# Altium schematic sheet 21 BOOT SELECT.SchDoc
size 513 x 386 mm
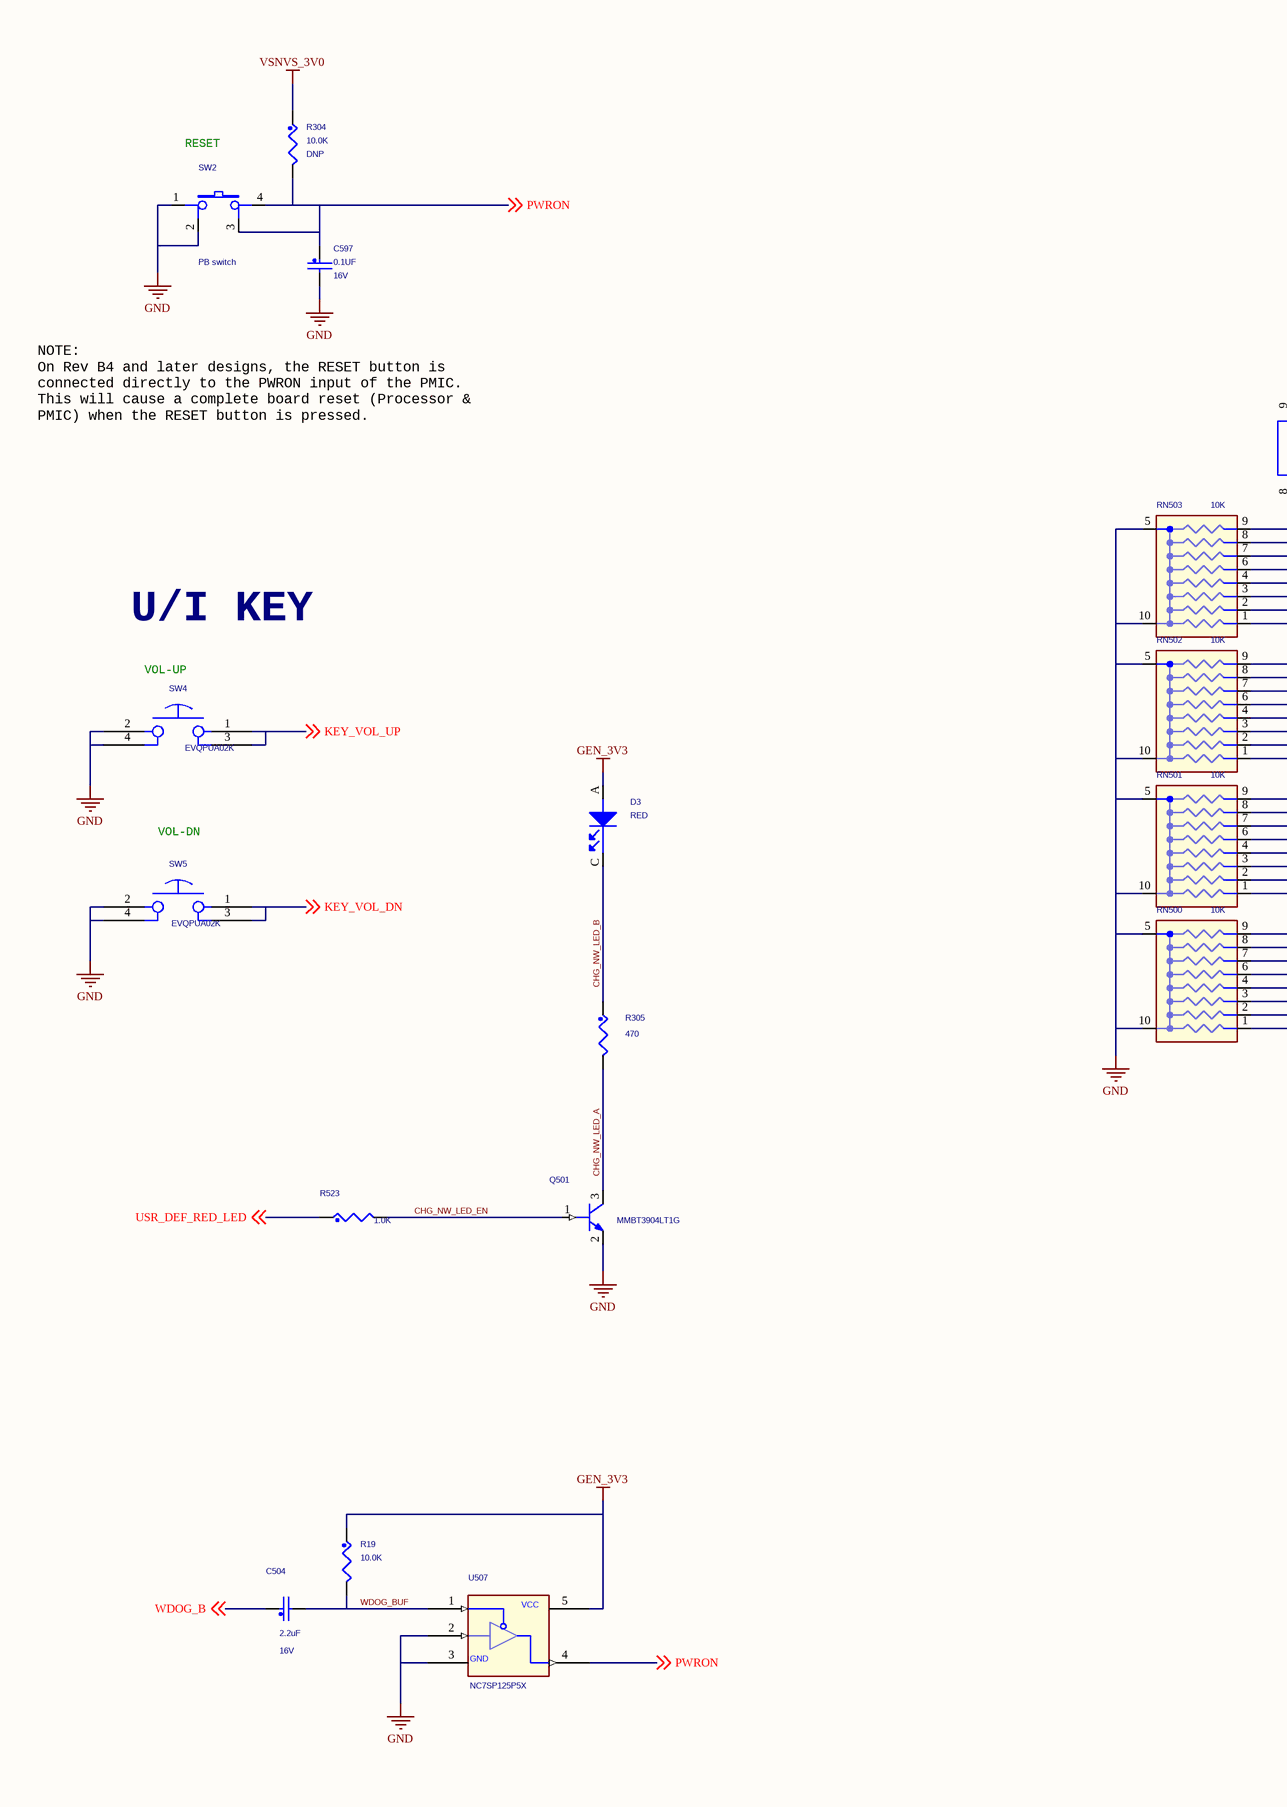
[diagram p0: 21 BOOT SELECT.SchDoc, left]
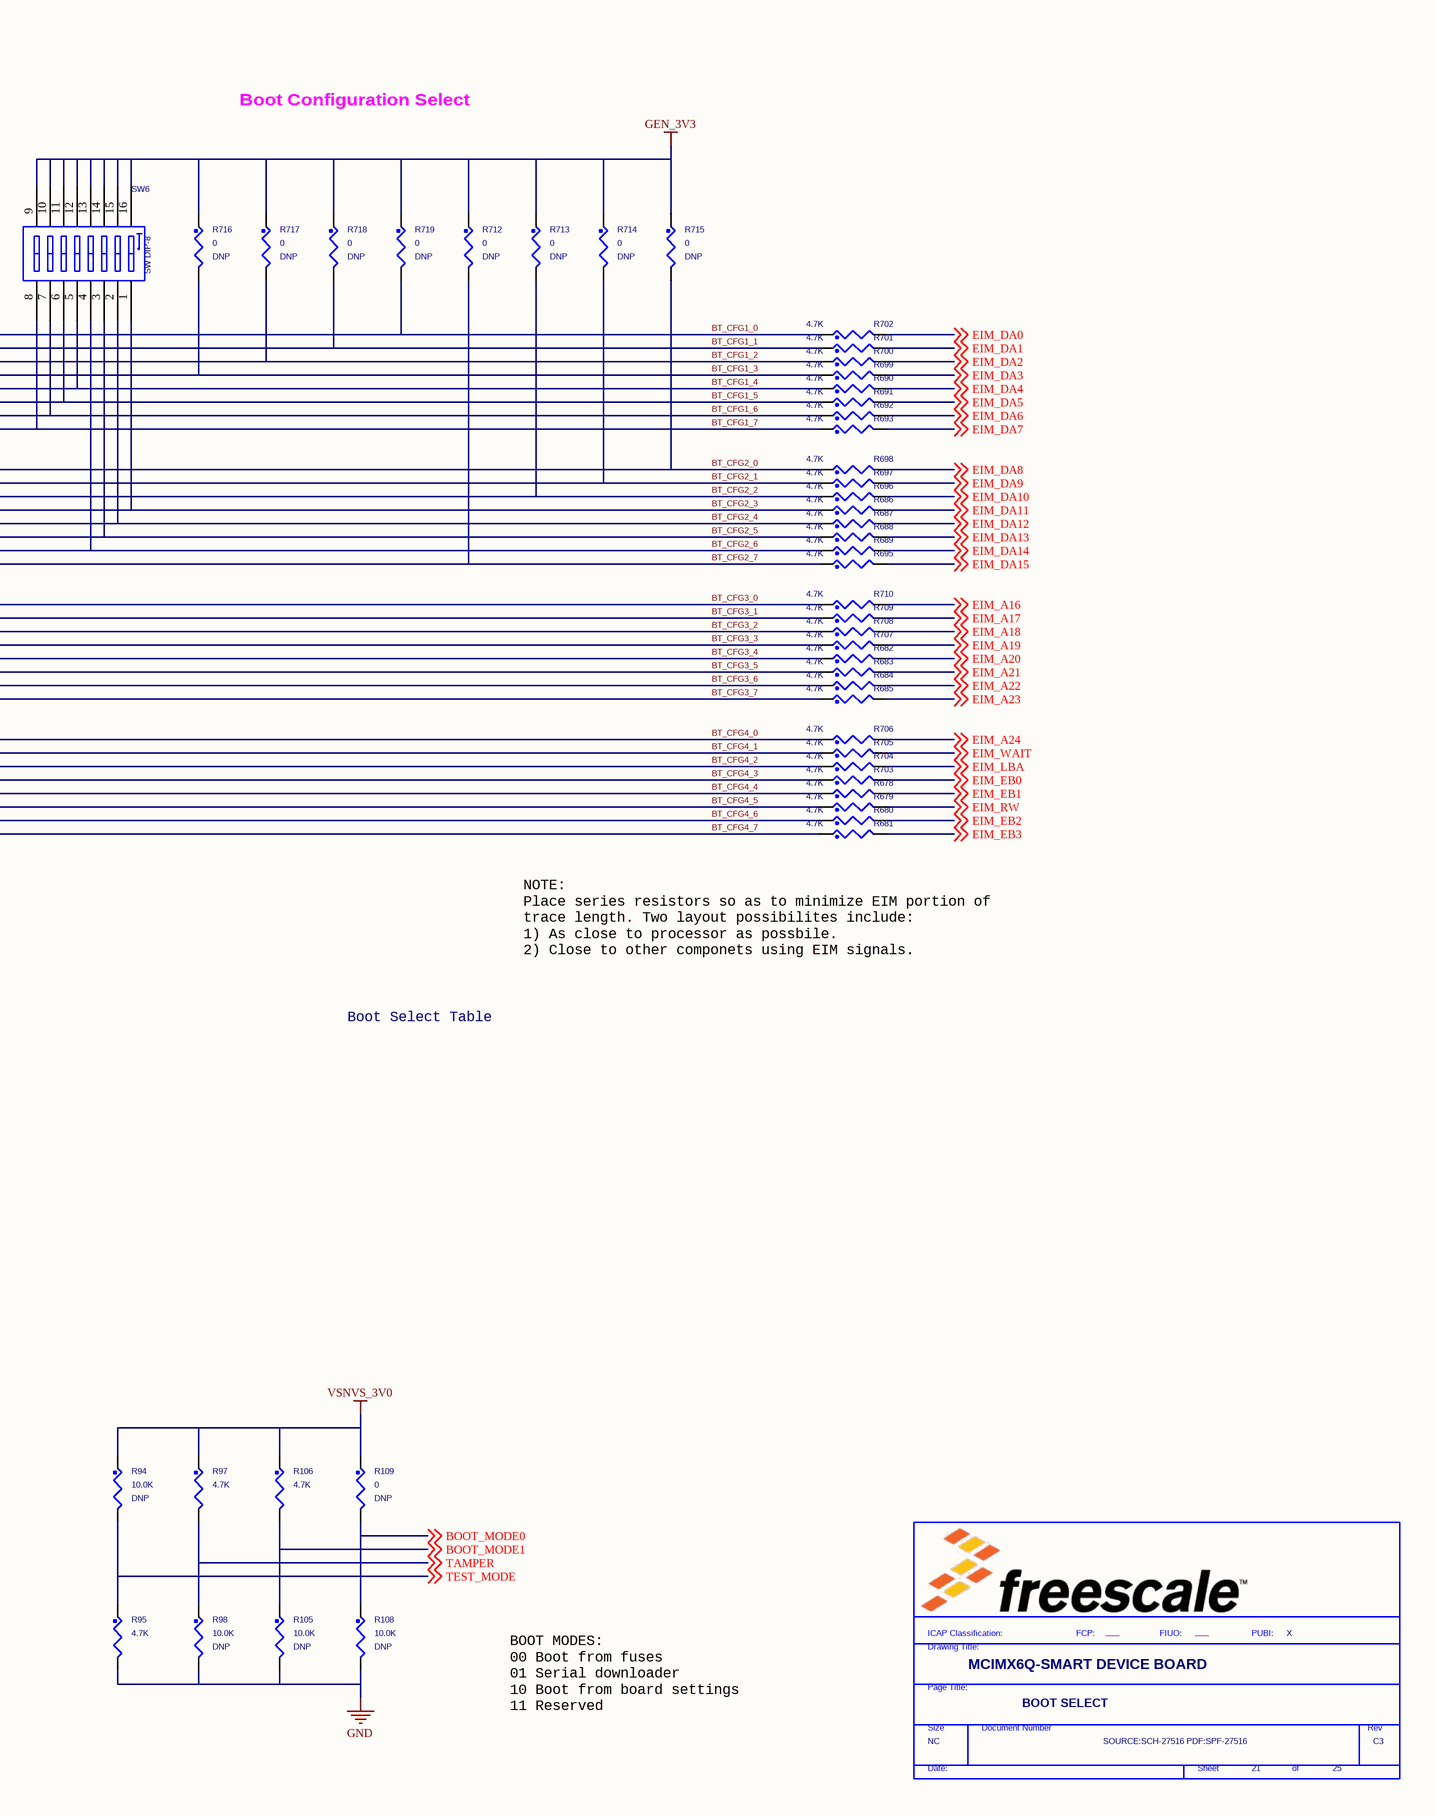
[diagram p1: 21 BOOT SELECT.SchDoc, right]

## Parts
*  FIUO: ___  PUBI: X  Doc: SOURCE:SCH-27516 PDF:SPF-27516  RevCode: C3  Title: MCIMX6Q-SMART DEVICE BOARD  Page Size: NC  Page Number: 21  Page Count: 25  PageTitle: BOOT SELECT  (hidden comment: TitleBlock_FS)  (graphical)
C504  2.2uF  WVDC: 16V  [0603_CC]
C597  0.1UF  WVDC: 16V  [0402_CC]
D3  RED  [LED_0603]
Q501  MMBT3904LT1G  [SOT23]
R19  10.0K  [0402_CC]
R94  10.0K  ASSY_OPT: DNP  [0402_CC]
R95  4.7K  [0402_CC]
R97  4.7K  [0402_CC]
R98  10.0K  ASSY_OPT: DNP  [0402_CC]
R105  10.0K  ASSY_OPT: DNP  [0402_CC]
R106  4.7K  [0402_CC]
R108  10.0K  ASSY_OPT: DNP  [0402_CC]
R109  0  ASSY_OPT: DNP  [0402_CC]
R304  10.0K  ASSY_OPT: DNP  [0402_CC]
R305  470  [0603_CC]
R523  1.0K  [0402_CC]
R678  4.7K  [0402_CC]
R679  4.7K  [0402_CC]
R680  4.7K  [0402_CC]
R681  4.7K  [0402_CC]
R682  4.7K  [0402_CC]
R683  4.7K  [0402_CC]
R684  4.7K  [0402_CC]
R685  4.7K  [0402_CC]
R686  4.7K  [0402_CC]
R687  4.7K  [0402_CC]
R688  4.7K  [0402_CC]
R689  4.7K  [0402_CC]
R690  4.7K  [0402_CC]
R691  4.7K  [0402_CC]
R692  4.7K  [0402_CC]
R693  4.7K  [0402_CC]
R695  4.7K  [0402_CC]
R696  4.7K  [0402_CC]
R697  4.7K  [0402_CC]
R698  4.7K  [0402_CC]
R699  4.7K  [0402_CC]
R700  4.7K  [0402_CC]
R701  4.7K  [0402_CC]
R702  4.7K  [0402_CC]
R703  4.7K  [0402_CC]
R704  4.7K  [0402_CC]
R705  4.7K  [0402_CC]
R706  4.7K  [0402_CC]
R707  4.7K  [0402_CC]
R708  4.7K  [0402_CC]
R709  4.7K  [0402_CC]
R710  4.7K  [0402_CC]
R712  0  ASSY_OPT: DNP  [0402_CC]
R713  0  ASSY_OPT: DNP  [0402_CC]
R714  0  ASSY_OPT: DNP  [0402_CC]
R715  0  ASSY_OPT: DNP  [0402_CC]
R716  0  ASSY_OPT: DNP  [0402_CC]
R717  0  ASSY_OPT: DNP  [0402_CC]
R718  0  ASSY_OPT: DNP  [0402_CC]
R719  0  ASSY_OPT: DNP  [0402_CC]
RN500  10K  [RCA_8_10]
RN501  10K  [RCA_8_10]
RN502  10K  [RCA_8_10]
RN503  10K  [RCA_8_10]
SW2  PB switch  [SW4_4MM]
SW4  EVQPUA02K  [sw_spst_pb_4p8x3p5_sm]
SW5  EVQPUA02K  [sw_spst_pb_4p8x3p5_sm]
SW6  SW DIP-8  [SW_DIP16_8POS_SM]
U507  NC7SP125P5X  [SC70-5_A]

## Nets
GEN_3V3: D3.A(ANODE) R19.1 R712.1 R713.1 R714.1 R715.1 R716.1 R717.1 R718.1 R719.1 SW6.9 SW6.10 SW6.11 SW6.12 SW6.13 SW6.14 SW6.15 SW6.16 U507.5(VCC)
GND: C597.2 Q501.2(EMITTER) R95.2 R98.2 R105.2 R108.2 RN500.5 RN500.10 RN501.5 RN501.10 RN502.5 RN502.10 RN503.5 RN503.10 SW2.1 SW2.2 SW4.2 SW4.4 SW5.2 SW5.4 U507.2(A) U507.3(GND)
VSNVS_3V0: R94.1 R97.1 R106.1 R109.1 R304.1
BOOT_MODE0: R108.1 R109.2 ; off-sheet BOOT_MODE0
BOOT_MODE1: R105.1 R106.2 ; off-sheet BOOT_MODE1
BT_CFG1_0: R702.1 R719.2 RN503.9
BT_CFG1_1: R701.1 R718.2 RN503.8
BT_CFG1_2: R700.1 R717.2 RN503.7
BT_CFG1_3: R699.1 R716.2 RN503.6
BT_CFG1_4: R690.1 RN503.4 SW6.5
BT_CFG1_5: R691.1 RN503.3 SW6.6
BT_CFG1_6: R692.1 RN503.2 SW6.7
BT_CFG1_7: R693.1 RN503.1 SW6.8
BT_CFG2_0: R698.1 R715.2 RN502.9
BT_CFG2_1: R697.1 R714.2 RN502.8
BT_CFG2_2: R696.1 R713.2 RN502.7
BT_CFG2_3: R686.1 RN502.6 SW6.1
BT_CFG2_4: R687.1 RN502.4 SW6.2
BT_CFG2_5: R688.1 RN502.3 SW6.3
BT_CFG2_6: R689.1 RN502.2 SW6.4
BT_CFG2_7: R695.1 R712.2 RN502.1
BT_CFG3_0: R710.1 RN501.9
BT_CFG3_1: R709.1 RN501.8
BT_CFG3_2: R708.1 RN501.7
BT_CFG3_3: R707.1 RN501.6
BT_CFG3_4: R682.1 RN501.4
BT_CFG3_5: R683.1 RN501.3
BT_CFG3_6: R684.1 RN501.2
BT_CFG3_7: R685.1 RN501.1
BT_CFG4_0: R706.1 RN500.9
BT_CFG4_1: R705.1 RN500.8
BT_CFG4_2: R704.1 RN500.7
BT_CFG4_3: R703.1 RN500.6
BT_CFG4_4: R678.1 RN500.4
BT_CFG4_5: R679.1 RN500.3
BT_CFG4_6: R680.1 RN500.2
BT_CFG4_7: R681.1 RN500.1
CHG_NW_LED_A: Q501.3(COLLECTOR) R305.2
CHG_NW_LED_B: D3.C(CATHODE) R305.1
CHG_NW_LED_EN: Q501.1(BASE) R523.2
EIM_A16: R710.2 ; off-sheet EIM_A16
EIM_A17: R709.2 ; off-sheet EIM_A17
EIM_A18: R708.2 ; off-sheet EIM_A18
EIM_A19: R707.2 ; off-sheet EIM_A19
EIM_A20: R682.2 ; off-sheet EIM_A20
EIM_A21: R683.2 ; off-sheet EIM_A21
EIM_A22: R684.2 ; off-sheet EIM_A22
EIM_A23: R685.2 ; off-sheet EIM_A23
EIM_A24: R706.2 ; off-sheet EIM_A24
EIM_DA0: R702.2 ; off-sheet EIM_DA0
EIM_DA1: R701.2 ; off-sheet EIM_DA1
EIM_DA2: R700.2 ; off-sheet EIM_DA2
EIM_DA3: R699.2 ; off-sheet EIM_DA3
EIM_DA4: R690.2 ; off-sheet EIM_DA4
EIM_DA5: R691.2 ; off-sheet EIM_DA5
EIM_DA6: R692.2 ; off-sheet EIM_DA6
EIM_DA7: R693.2 ; off-sheet EIM_DA7
EIM_DA8: R698.2 ; off-sheet EIM_DA8
EIM_DA9: R697.2 ; off-sheet EIM_DA9
EIM_DA10: R696.2 ; off-sheet EIM_DA10
EIM_DA11: R686.2 ; off-sheet EIM_DA11
EIM_DA12: R687.2 ; off-sheet EIM_DA12
EIM_DA13: R688.2 ; off-sheet EIM_DA13
EIM_DA14: R689.2 ; off-sheet EIM_DA14
EIM_DA15: R695.2 ; off-sheet EIM_DA15
EIM_EB0: R703.2 ; off-sheet EIM_EB0
EIM_EB1: R678.2 ; off-sheet EIM_EB1
EIM_EB2: R680.2 ; off-sheet EIM_EB2
EIM_EB3: R681.2 ; off-sheet EIM_EB3
EIM_LBA: R704.2 ; off-sheet EIM_LBA
EIM_RW: R679.2 ; off-sheet EIM_RW
EIM_WAIT: R705.2 ; off-sheet EIM_WAIT
KEY_VOL_DN: SW5.1 SW5.3 ; off-sheet KEY_VOL_DN
KEY_VOL_UP: SW4.1 SW4.3 ; off-sheet KEY_VOL_UP
PWRON: C597.1 R304.2 SW2.3 SW2.4 U507.4(Y) ; off-sheet PWRON
TAMPER: R97.2 R98.1 ; off-sheet TAMPER
TEST_MODE: R94.2 R95.1 ; off-sheet TEST_MODE
USR_DEF_RED_LED: R523.1 ; off-sheet USR_DEF_RED_LED
WDOG_B: C504.1 ; off-sheet WDOG_B
WDOG_BUF: C504.2 R19.2 U507.1(~{OE})

## Notes on the sheet
- RESET
- Boot Configuration Select
- NOTE:
  On Rev B4 and later designs, the RESET button is
  connected directly to the PWRON input of the PMIC.
  This will cause a complete board reset (Processor &
  PMIC) when the RESET button is pressed.
- U/I KEY
- VOL-UP
- VOL-DN
- NOTE:
  Place series resistors so as to minimize EIM portion of
  trace length. Two layout possibilites include:
  1) As close to processor as possbile.
  2) Close to other componets using EIM signals.
- Boot Select Table
- BOOT MODES:
  00 Boot from fuses
  01 Serial downloader
  10 Boot from board settings
  11 Reserved
- (in symbol TitleBlock_FS) ICAP Classification:; FCP:; FIUO:; PUBI:; Drawing Title:; Page Title:; Size; Document Number; Rev; Date:; Sheet; of

## Library data of the parts
* = TitleBlock_FS: OrgAddr2: Austin, TX 78735-8598; OrgAddr1: 6501 William Cannon Drive West; OrgName: Freescale Semiconductor; FCP: ___; Page Create Date: March  8, 1995
C504 = CAP_NP: CAP CER 2.2UF 16V 10% X5R 0603; CLASS: DISCRETE; AGILE_PN: 150-75417; MFG_NAME01: MURATA; MFG_PN01: GRM188R61C225KE15D; CAD_APPROVED: YES; FPLIST: CC0603_OV,CC0603,0603_CC; Tolerance: 10%; ROHS: Yes; HEIGHT: 0.9 MM; VOLTAGE: 16V
C597 = CAP_NP: CAP CER 0.1UF 16V 10% X7R 0402; CLASS: DISCRETE; AGILE_PN: 150-75182; MFG_NAME01: KEMET; MFG_PN01: C0402C104K4RAC; CAD_APPROVED: Yes; FPLIST: CC0402_25,CC0402_HD,0402_CC; SIGNAL_MODEL: DEFAULT_CAPACITOR_100000pF_2_1; Tolerance: 10%; ROHS: Yes; HEIGHT: 0.635MM; VOLTAGE: 16V
D3 = LED: LED ULTRA BRIGHT RED SGL 30MA 0603; CLASS: IC; CAD_APPROVED: Yes; MFG_PN01: LTST-C190KRKT; MFG_NAME01: LITE ON; AGILE_PN: 370-75079; HEIGHT: 0.9MM; ROHS: Yes
Q501 = NPN: TRAN NPN GEN 200MA 40V SOT-23; CLASS: IC; AGILE_PN: 480-75173; MFG_NAME01: ON SEMICONDUCTOR; CAD_APPROVED: Yes; MFG_PN01: MMBT3904LT1G; ROHS: Yes; HEIGHT: 1.12 MM
R19 = RES: RES MF 10.0K 1/16W 1% 0402; CLASS: DISCRETE; FPLIST: RC0402_25,RC0402_HD,0402_CC; CAD_APPROVED: Yes; MFG_PN01: CRCW040210K0FKED; MFG_NAME01: VISHAY INTERTECHNOLOGY; AGILE_PN: 470-75416; ROHS: Yes; Tolerance: 1%
R94 = RES: RES MF 10.0K 1/16W 1% 0402; CLASS: DISCRETE; SIGNAL_MODEL: DEFAULT_RESISTOR_10000OHM_2_1; FPLIST: RC0402_25,RC0402_HD,0402_CC; ROOM: MARLEY; AGILE_PN: 470-75416; MFG_NAME01: VISHAY INTERTECHNOLOGY; MFG_PN01: CRCW040210K0FKED; CAD_APPROVED: Yes; PRIORITY_PN: 006-00552; Tolerance: 1%; ROHS: Yes
R95 = RES: RES MF 4.70K 1/16W 1% 0402; CLASS: DISCRETE; SIGNAL_MODEL: DEFAULT_RESISTOR_4700OHM_2_1; ROOM: MARLEY; PRIORITY_PN: 006-00619; CAD_APPROVED: Yes; MFG_PN01: RK73H1ETTP4701F; MFG_NAME01: KOA SPEER; AGILE_PN: 470-75418; ROHS: Yes; Tolerance: 1%
R97 R106 = RES: RES MF 4.70K 1/16W 1% 0402; CLASS: DISCRETE; FPLIST: RC0402_25,RC0402_HD,0402_CC; CAD_APPROVED: Yes; MFG_PN01: RK73H1ETTP4701F; MFG_NAME01: KOA SPEER; AGILE_PN: 470-75418; SIGNAL_MODEL: DEFAULT_RESISTOR_0.001OHM_2_1; ROHS: Yes; Tolerance: 1%
R98 R108 = RES: RES MF 10.0K 1/16W 1% 0402; CLASS: DISCRETE; SIGNAL_MODEL: DEFAULT_RESISTOR_10000OHM_2_1; AGILE_PN: 470-75416; MFG_NAME01: VISHAY INTERTECHNOLOGY; MFG_PN01: CRCW040210K0FKED; CAD_APPROVED: Yes; FPLIST: RC0402_25,RC0402_HD,0402_CC; Tolerance: 1%; ROHS: Yes
R105 = RES: RES MF 10.0K 1/16W 1% 0402; CLASS: DISCRETE; SIGNAL_MODEL: DEFAULT_RESISTOR_10000OHM_2_1; FPLIST: RC0402_25,RC0402_HD,0402_CC; CAD_APPROVED: Yes; MFG_PN01: CRCW040210K0FKED; MFG_NAME01: VISHAY INTERTECHNOLOGY; AGILE_PN: 470-75416; ROHS: Yes; Tolerance: 1%
R109 = RES: RES MF ZERO OHM 1/10W -- 0402; CLASS: DISCRETE; SIGNAL_MODEL: DEFAULT_RESISTOR_0.001OHM_2_1; AGILE_PN: 470-79965; MFG_NAME01: Panasonic; MFG_PN01: ERJ-2GE0R00X; CAD_APPROVED: Yes; FPLIST: RC0402_25,RC0402_HD,RC0402_X2,0402_CC; ROHS: Yes
R304 = RES: RES MF 10.0K 1/16W 1% 0402; CLASS: DISCRETE; FPLIST: RC0402_25,RC0402_HD,0402_CC; CAD_APPROVED: Yes; MFG_PN01: CRCW040210K0FKED; MFG_NAME01: VISHAY INTERTECHNOLOGY; AGILE_PN: 470-75416; SIGNAL_MODEL: DEFAULT_RESISTOR_10000OHM_2_1; ROHS: Yes; Tolerance: 1%
R305 = RES: RES MF 470 OHM 1/10W 1% 0603; CLASS: DISCRETE; AGILE_PN: 470-30133; MFG_NAME01: KOA SPEER; MFG_PN01: RK73H1JTTD4700F; CAD_APPROVED: Yes; FPLIST: RC0603_OV,RC0603,0603_CC; SIGNAL_MODEL: DEFAULT_RESISTOR_470OHM_2_1; Tolerance: 1%; TOL: 1%; ROHS: Yes; HEIGHT: 0.55 MM
R523 = RES: RES MF 1.0K 1/16W 1% 0402; CLASS: DISCRETE; SIGNAL_MODEL: DEFAULT_RESISTOR_1000OHM_2_1; FPLIST: RC0402_25,RC0402_HD,RC0402_X2,0402_CC; CAD_APPROVED: Yes; MFG_PN01: RK73H1ETTP1001F; MFG_NAME01: KOA SPEER; AGILE_PN: 470-76037; ROHS: Yes; Tolerance: 1%
R678-R685 R698 R703-R705 R707-R709 = RES: RES MF 4.70K 1/16W 1% 0402; CLASS: DISCRETE; PRIORITY_PN: 006-00619; CAD_APPROVED: Yes; MFG_PN01: RK73H1ETTP4701F; MFG_NAME01: KOA SPEER; AGILE_PN: 470-75418; ROOM: ETM; SIGNAL_MODEL: DEFAULT_RESISTOR_4700OHM_2_1; ROHS: Yes; Tolerance: 1%
R686-R693 R695-R697 R699-R702 R706 R710 = RES: RES MF 4.70K 1/16W 1% 0402; CLASS: DISCRETE; ROOM: ETM; AGILE_PN: 470-75418; MFG_NAME01: KOA SPEER; MFG_PN01: RK73H1ETTP4701F; CAD_APPROVED: Yes; PRIORITY_PN: 006-00619; SIGNAL_MODEL: DEFAULT_RESISTOR_4700OHM_2_1; Tolerance: 1%; ROHS: Yes
R712-R719 = RES: RES MF ZERO OHM 1/10W -- 0402; CLASS: DISCRETE; AGILE_PN: 470-79965; MFG_NAME01: Panasonic; MFG_PN01: ERJ-2GE0R00X; CAD_APPROVED: Yes; FPLIST: RC0402_25,RC0402_HD,RC0402_X2,0402_CC; SIGNAL_MODEL: DEFAULT_RESISTOR_0.001OHM_2_1; ROHS: Yes
RN500 RN501 = NETW_B8_10P: RNET BUS 8 10K 1/32W 5% SMT; CLASS: DISCRETE; AGILE_PN: 470-75833; MFG_NAME01: ROHM; MFG_PN01: MNR15E0RPJ103; CAD_APPROVED: Yes; FPLIST: RCA_8_10, mnr15; PRIORITY_PN: 051-00078; Tolerance: 5%; ROHS: Yes
RN502 RN503 = NETW_B8_10P: RNET BUS 8 10K 1/32W 5% SMT; CLASS: DISCRETE; PRIORITY_PN: 051-00078; FPLIST: RCA_8_10, mnr15; CAD_APPROVED: Yes; MFG_PN01: MNR15E0RPJ103; MFG_NAME01: ROHM; AGILE_PN: 470-75833; ROHS: Yes; Tolerance: 5%
SW2 = SW_TACT-SPST-2_SM: SW SMT 4.0MM FMS 0.1A MAX 16V MAX ROHS COMPLIANT; CLASS: IC; AGILE_PN: 510-75078; MFG_NAME01: BOURNS; MFG_PN01: 7914J-1-000E; CAD_APPROVED: Yes; ROHS: Yes; HEIGHT: 4.19 MM
SW4 SW5 = EDGE_MOUNT_PB_SW_2: SW SPST NO PB 2.2N SIDE 12V 50MA SMT; CLASS: IC; AGILE_PN: 510-76838; MFG_NAME01: PANASONIC; CAD_APPROVED: Yes; MFG_PN01: EVQPUA02K; ROHS: Yes; HEIGHT: 1.95MM
SW6 = SW_DIP_8: SW SPST DIP 24V 16.67MA SMT; CLASS: IC; AGILE_PN: 510-75134; MFG_NAME01: TYCO ELECTRONICS; MFG_PN01: 1-1571983-1; CAD_APPROVED: Yes; PRIORITY_PN: 040-00054; ROHS: Yes; HEIGHT: 2.36MM
U507 = 1G125: IC BUF TS 0.9-3.6V; AGILE_PN: 312-30153; MFG_NAME01: FAIRCHILD; CAD_APPROVED: Yes; CLASS: IC; MFG_PN01: NC7SP125P5X; ROHS: Yes; HEIGHT: 1.1MM